# EAGLE board fc-comms (EAGLE 6.6.0), part 1 of 2
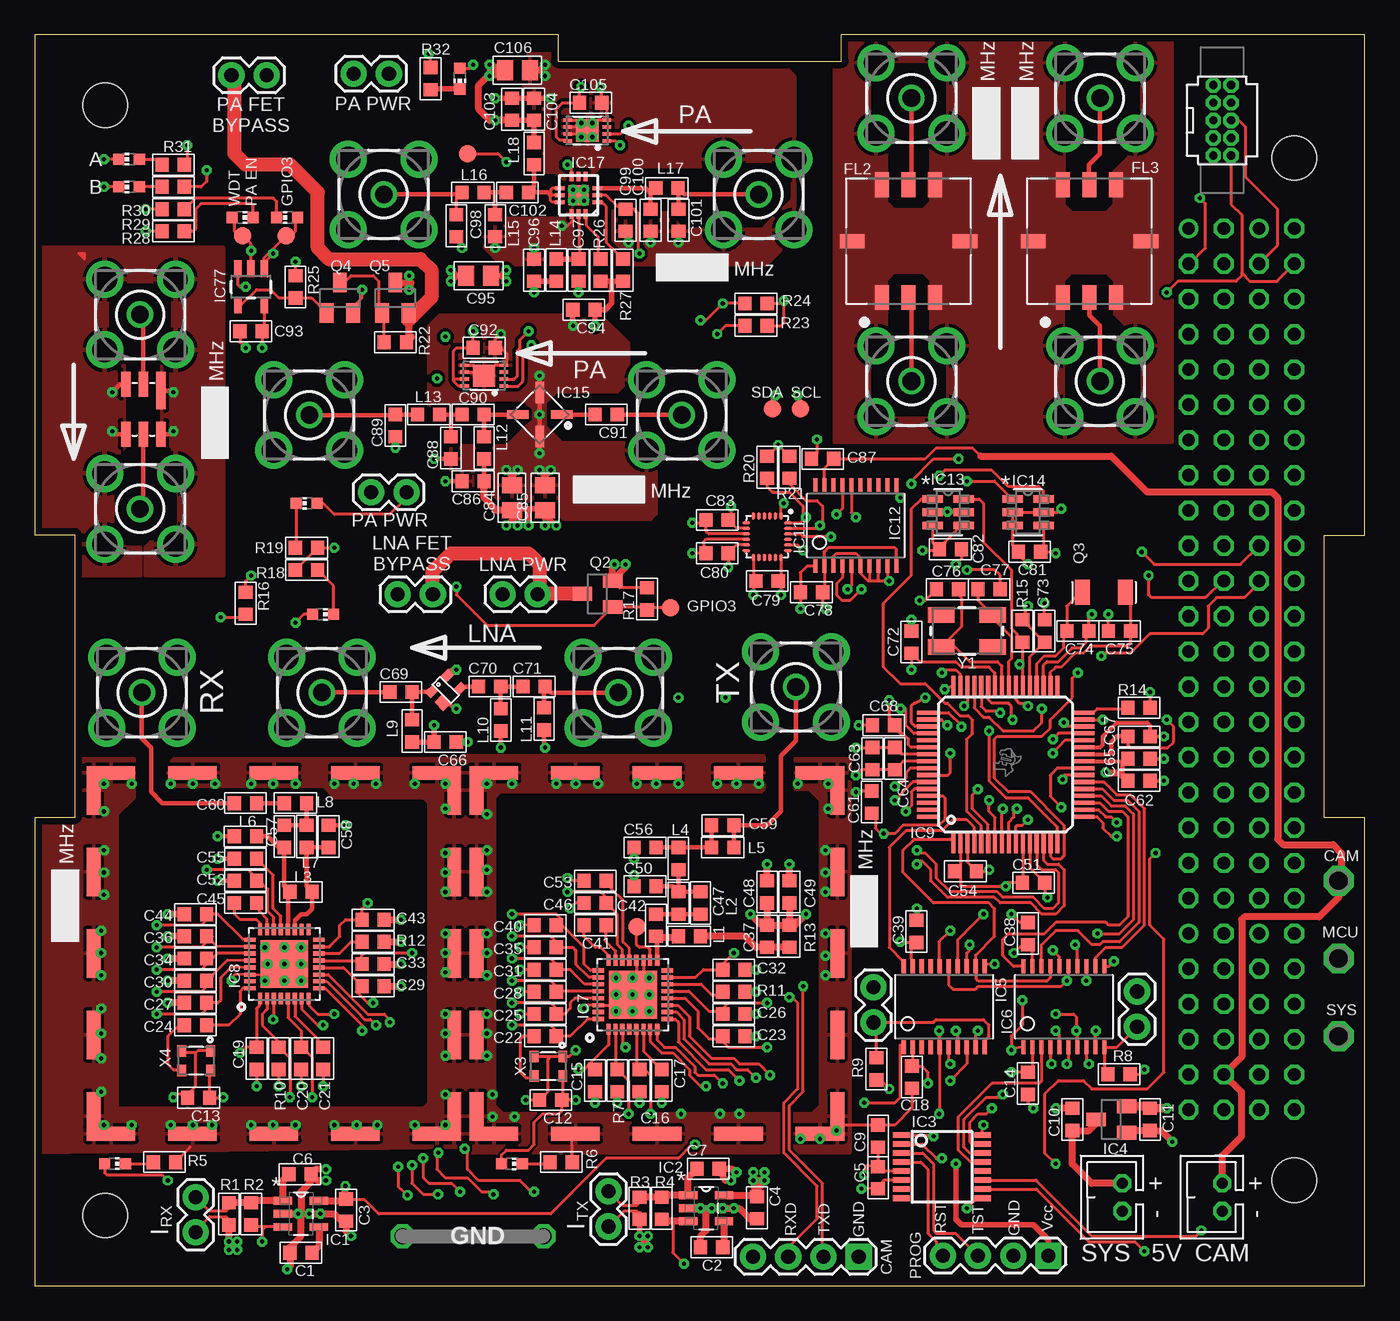
[diagram p2: board, top side]
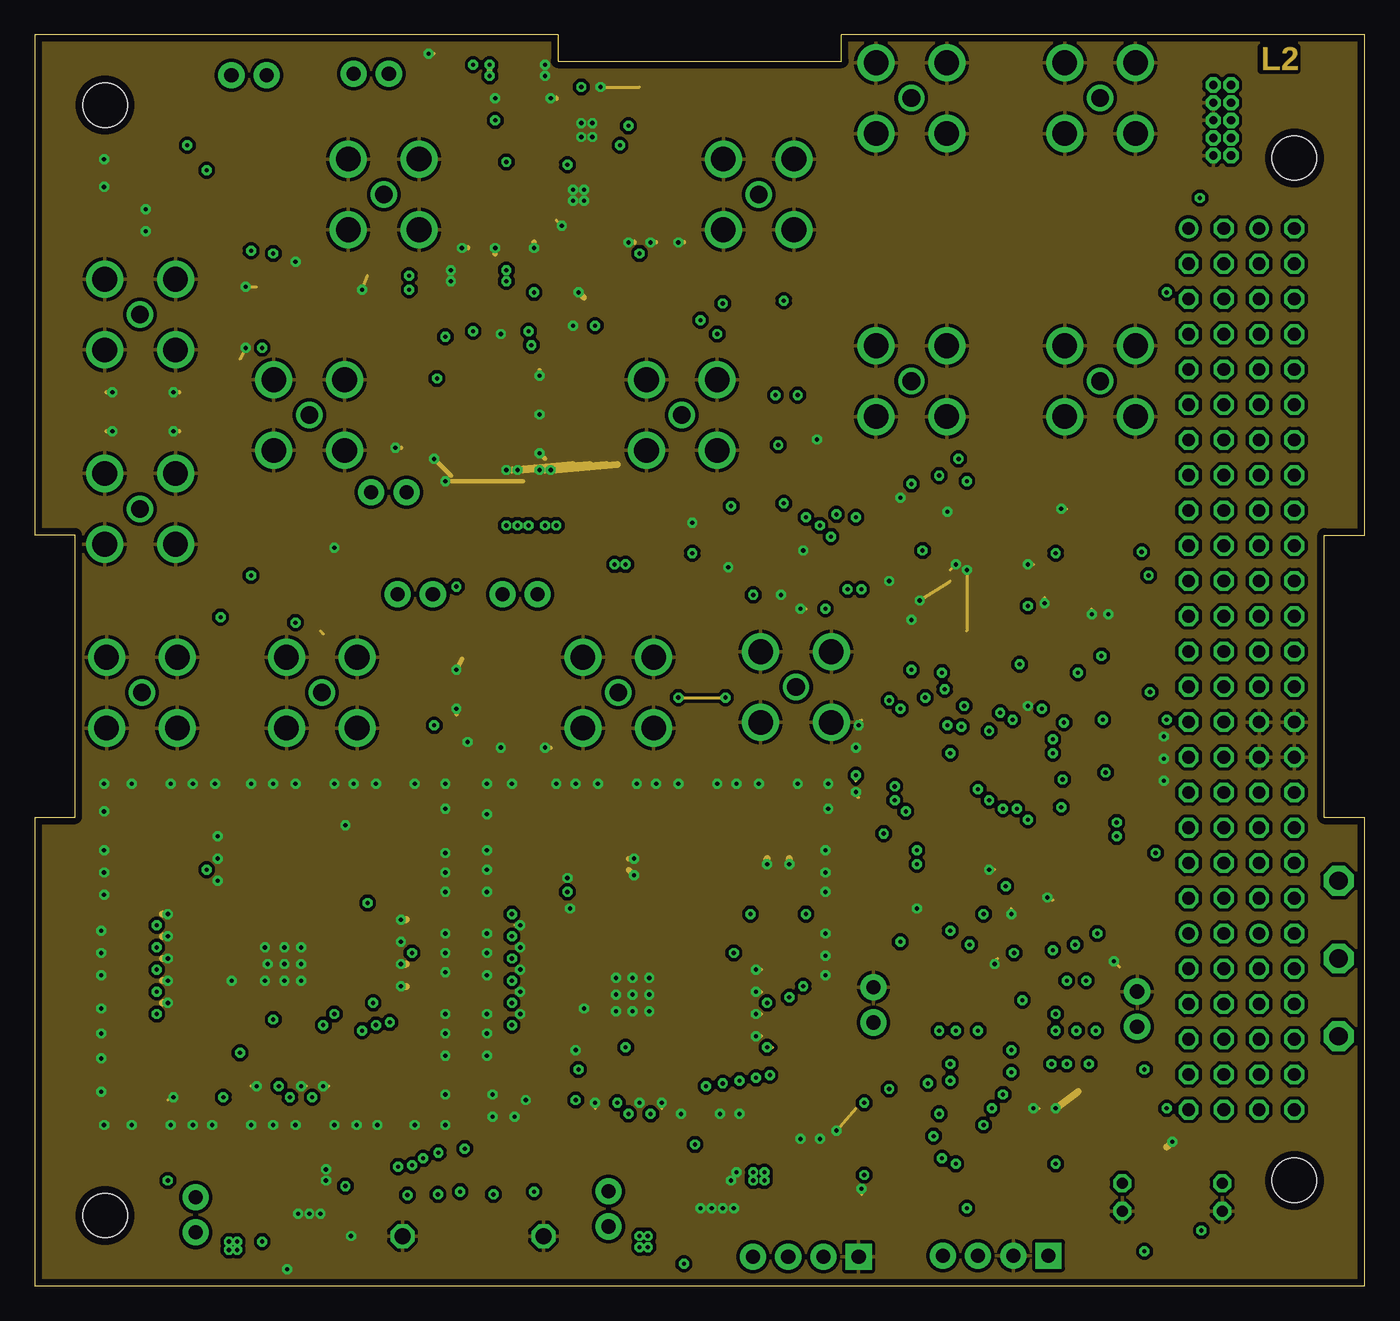
[diagram p3: board, inner layer Route2]
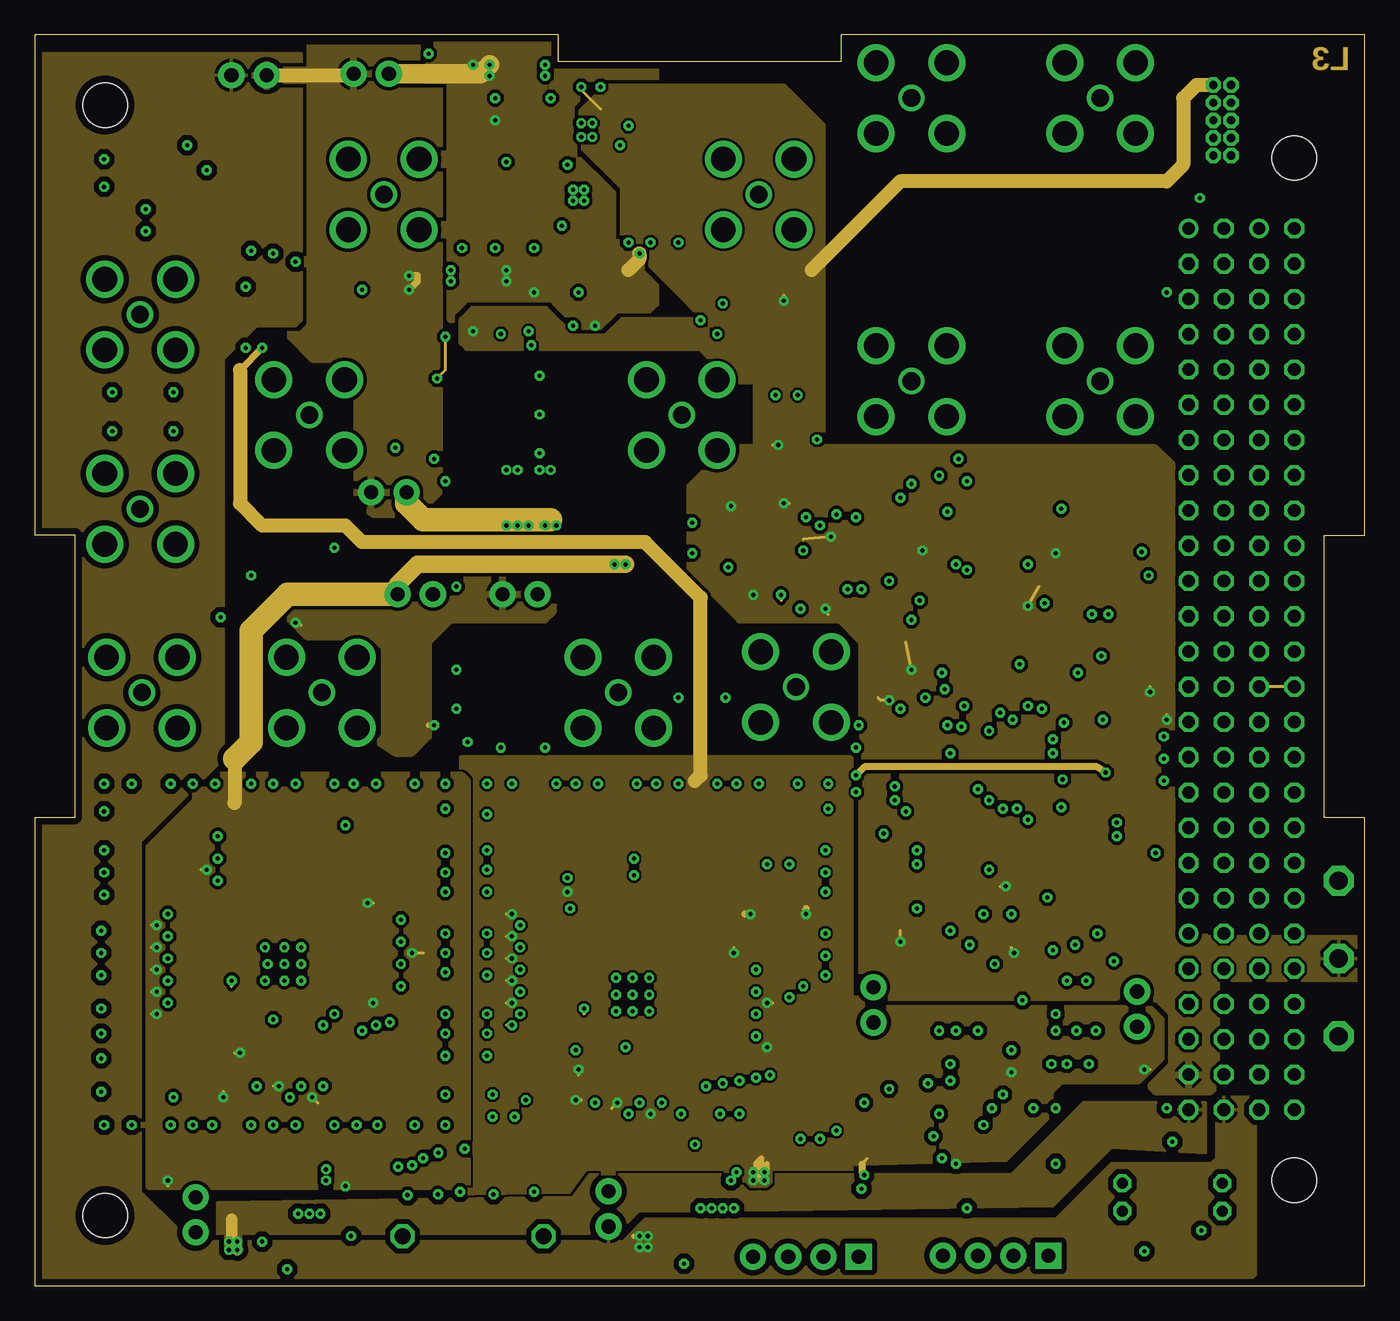
[diagram p4: board, inner layer Route15]
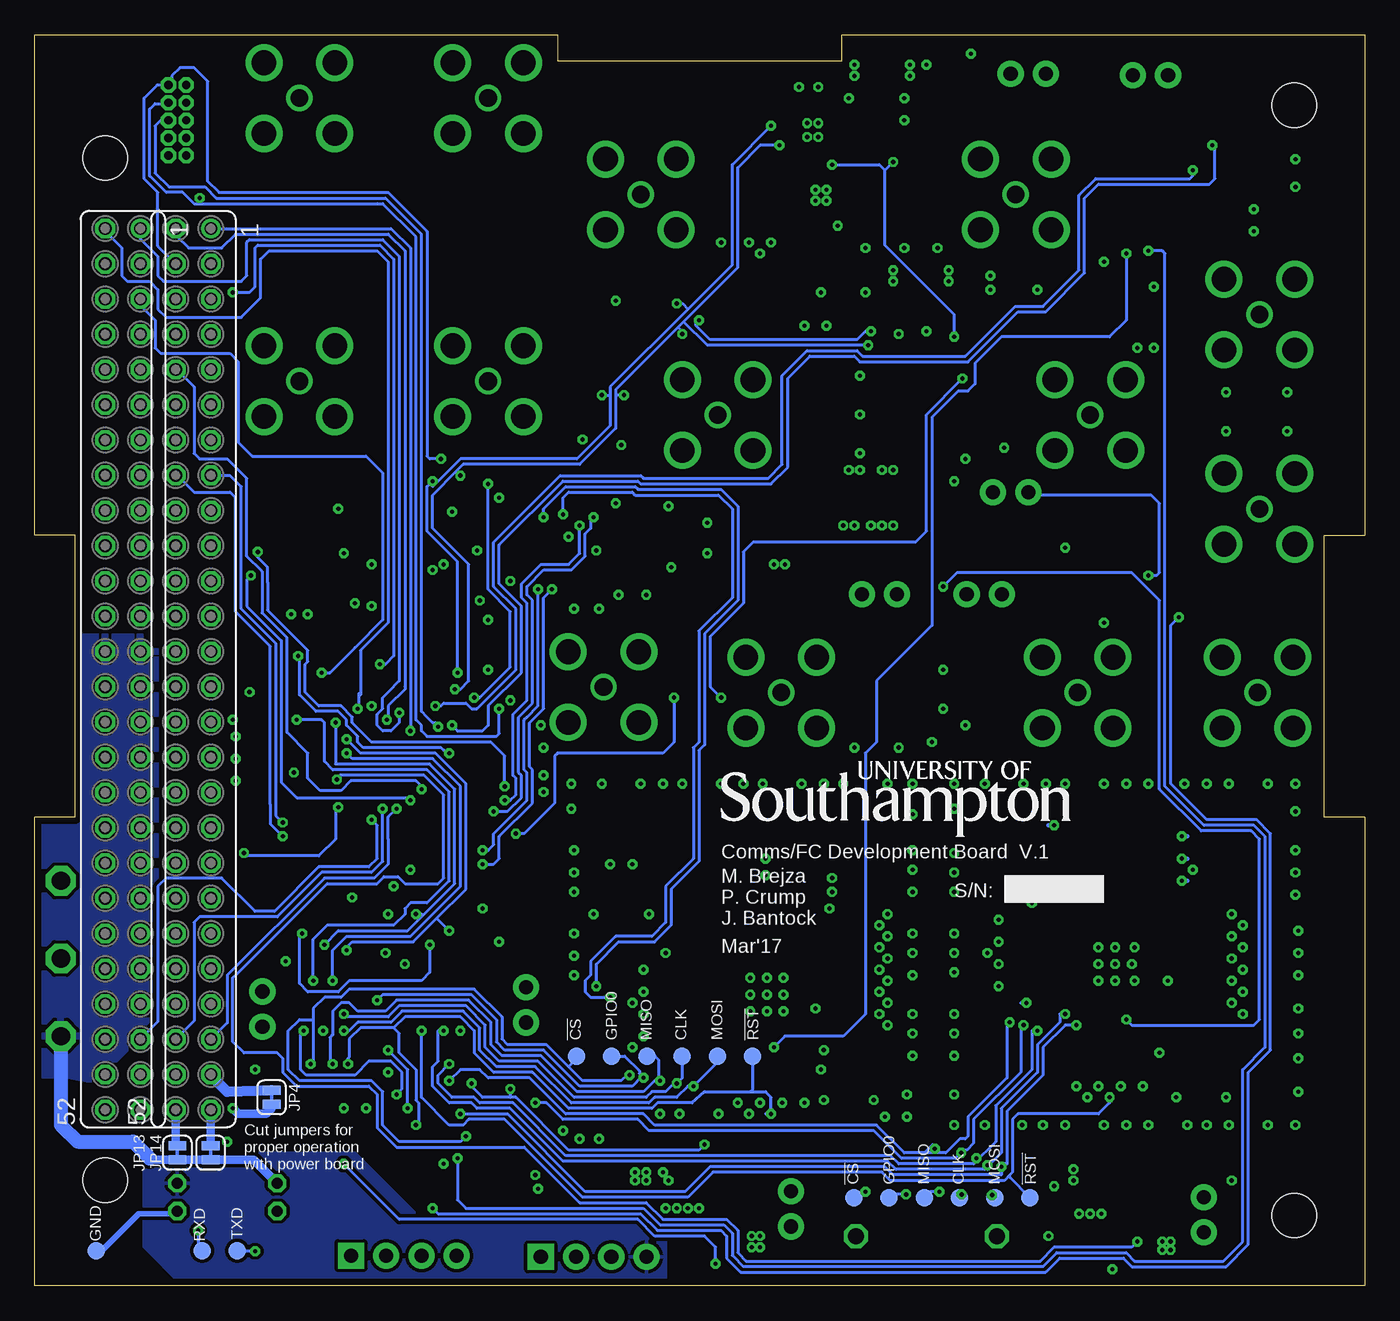
[diagram p5: board, bottom side, seen from below]

Size 95.89 x 90.17 mm. Coordinates in mm from the lower left corner, seen from the top.
Copper layers (1*2*15*16): Top 0.035mm / dielectric 0.15mm / Route2 0.035mm / dielectric 1.2mm / Route15 0.035mm / dielectric 0.15mm / Bottom 0.035mm
Design rules "default *": minimum track width 0.2mm, minimum drill 12mil, track to track 7mil, track to pad 7mil, pad to pad 7mil, via to via 8mil, smd to smd 5mil, copper to edge 20mil, drill to drill 8mil, minimum pad ring 10mil, minimum via ring 8mil, stop-mask expansion 4mil, vias tented up to drill 15mil, thermal gap 10mil

## Footprints (pad centres in the part's own frame; a part is rotated, then mirrored left to right if it is on the bottom)
C0603-N = smd 0.95 x 1: 1 -0.8,0; 2 0.8,0
C0805-N = smd 1.15 x 1.45: 1 -0.9,0; 2 0.9,0
GOLLEDGE_SAW = smd 2.7 x 0.7: A 1.35,-1.27 | smd 1.8 x 0.7: B 1.8,0; C 1.8,1.27; D -1.8,1.27; E -1.8,0; F -1.8,-1.27
PL-176 = smd 1.016 x 1.778: 1 -1.905,-4.064; 2 0,-4.064; 3 1.905,-4.064; 5 1.905,4.064; 6 0,4.064; 7 -1.905,4.064 | smd 1.778 x 1.016: 4 4.064,0; 8 -4.064,0
GND-LOOP-0.4 = drill 1.15 octagon: P$3 -5.08,0; P$4 5.08,0
SOT95P280X110-5N = smd 1.321 x 0.559: 1 -1.295,0.94; 2 -1.295,0; 3 -1.295,-0.94; 4 1.295,-0.94; 5 1.295,0.94
SSOP16 = smd 0.4 x 1.2: 1 -2.275,-2.925; 2 -1.625,-2.925; 3 -0.975,-2.925; 4 -0.325,-2.925; 5 0.325,-2.925; 6 0.975,-2.925; 7 1.625,-2.925; 8 2.275,-2.925; 9 2.275,2.925; 10 1.625,2.925; 11 0.975,2.925; 12 0.325,2.925; 13 -0.325,2.925; 14 -0.975,2.925; 15 -1.625,2.925; 16 -2.275,2.925
SOT23 = smd 1 x 1.4: 1 -0.95,-1.1; 2 0.95,-1.1; 3 0,1.1
TSSOP20 = smd 0.305 x 0.991: 1 -2.925,-2.918; 2 -2.275,-2.918; 3 -1.625,-2.918; 4 -0.975,-2.918; 5 -0.325,-2.918; 6 0.325,-2.918; 7 0.975,-2.918; 8 1.625,-2.918; 9 2.275,-2.918; 10 2.925,-2.918; 11 2.925,2.918; 12 2.275,2.918; 13 1.625,2.918; 14 0.975,2.918; 15 0.325,2.918; 16 -0.325,2.918; 17 -0.975,2.918; 18 -1.625,2.918; 19 -2.275,2.918; 20 -2.925,2.918
QFN32_5X5 = smd 0.813 x 0.305: 1 -2.489,1.753; 2 -2.489,1.245; 3 -2.489,0.762; 4 -2.489,0.254; 5 -2.489,-0.254; 6 -2.489,-0.762; 7 -2.489,-1.245; 8 -2.489,-1.753; 17 2.489,-1.753; 18 2.489,-1.245; 19 2.489,-0.762; 20 2.489,-0.254; 21 2.489,0.254; 22 2.489,0.762; 23 2.489,1.245; 24 2.489,1.753 | smd 0.305 x 0.813: 9 -1.753,-2.489; 10 -1.245,-2.489; 11 -0.762,-2.489; 12 -0.254,-2.489; 13 0.254,-2.489; 14 0.762,-2.489; 15 1.245,-2.489; 16 1.753,-2.489; 25 1.753,2.489; 26 1.245,2.489; 27 0.762,2.489; 28 0.254,2.489; 29 -0.254,2.489; 30 -0.762,2.489; 31 -1.245,2.489; 32 -1.753,2.489 | smd 3.45 x 3.45: 33 0,0
PM_S-PQFP-G64 = smd 1.6 x 0.3: 1 -5.6,3.75; 2 -5.6,3.25; 3 -5.6,2.75; 4 -5.6,2.25; 5 -5.6,1.75; 6 -5.6,1.25; 7 -5.6,0.75; 8 -5.6,0.25; 9 -5.6,-0.25; 10 -5.6,-0.75; 11 -5.6,-1.25; 12 -5.6,-1.75; 13 -5.6,-2.25; 14 -5.6,-2.75; 15 -5.6,-3.25; 16 -5.6,-3.75; 33 5.6,-3.75; 34 5.6,-3.25; 35 5.6,-2.75; 36 5.6,-2.25; 37 5.6,-1.75; 38 5.6,-1.25; 39 5.6,-0.75; 40 5.6,-0.25; 41 5.6,0.25; 42 5.6,0.75; 43 5.6,1.25; 44 5.6,1.75; 45 5.6,2.25; 46 5.6,2.75; 47 5.6,3.25; 48 5.6,3.75 | smd 0.3 x 1.6: 17 -3.75,-5.6; 18 -3.25,-5.6; 19 -2.75,-5.6; 20 -2.25,-5.6; 21 -1.75,-5.6; 22 -1.25,-5.6; 23 -0.75,-5.6; 24 -0.25,-5.6; 25 0.25,-5.6; 26 0.75,-5.6; 27 1.25,-5.6; 28 1.75,-5.6; 29 2.25,-5.6; 30 2.75,-5.6; 31 3.25,-5.6; 32 3.75,-5.6; 49 3.75,5.6; 50 3.25,5.6; 51 2.75,5.6; 52 2.25,5.6; 53 1.75,5.6; 54 1.25,5.6; 55 0.75,5.6; 56 0.25,5.6; 57 -0.25,5.6; 58 -0.75,5.6; 59 -1.25,5.6; 60 -1.75,5.6; 61 -2.25,5.6; 62 -2.75,5.6; 63 -3.25,5.6; 64 -3.75,5.6
LNA_MMM1362 = smd 0.6 x 0.8: 1 0,0; 3 1.3,1.6; 4 0,1.6 | smd 0.9 x 0.8: 2 1.15,0
QFN-24/3MM = smd 0.6 x 0.23: 1 -1.5,1; 2 -1.5,0.6; 3 -1.5,0.2; 4 -1.5,-0.2; 5 -1.5,-0.6; 6 -1.5,-1; 13 1.5,-1; 14 1.5,-0.6; 15 1.5,-0.2; 16 1.5,0.2; 17 1.5,0.6; 18 1.5,1 | smd 0.23 x 0.6: 7 -1,-1.5; 8 -0.6,-1.5; 9 -0.2,-1.5; 10 0.2,-1.5; 11 0.6,-1.5; 12 1,-1.5; 19 1,1.5; 20 0.6,1.5; 21 0.2,1.5; 22 -0.2,1.5; 23 -0.6,1.5; 24 -1,1.5
DBV6 = smd 1.473 x 0.559: 1 -1.118,0.95; 2 -1.118,0; 3 -1.118,-0.95; 4 1.118,-0.95; 5 1.118,0; 6 1.118,0.95
PA = smd 1.55 x 0.61: GND1 -1.59,0; GND2 1.59,0 | smd 0.61 x 1.55: RF_IN 0,-1.59; RF_OUT 0,1.59
HWSON8 = smd 0.25 x 0.625: 1 -0.75,-1.41; 2 -0.25,-1.41; 3 0.25,-1.41; 4 0.75,-1.41; 5 0.75,1.41; 6 0.25,1.41; 7 -0.25,1.41; 8 -0.75,1.41 | smd 1.6 x 1.6: EP 0,0
QFN3X3-6 = smd 0.7 x 0.3: 1 -1.35,0.5; 2 -1.35,0; 3 -1.35,-0.5; 7 1.35,-0.5; 8 1.35,0; 9 1.35,0.5 | smd 0.3 x 0.7: 4 -0.5,-1.35; 5 0,-1.35; 6 0.5,-1.35; 10 0.5,1.35; 11 0,1.35; 12 -0.5,1.35 | smd 1.45 x 1.45: EXP 0,0
SOT23-5 = smd 0.55 x 1.2: 1 -0.95,-1.3; 2 0,-1.3; 3 0.95,-1.3; 4 0.95,1.3; 5 -0.95,1.3
JST-2-TH = drill 0.8 octagon: 1 1,0; 2 -1,0
SWD_PTH_SHROUD = drill 0.6 octagon: 1 -2.54,-0.635; 2 -2.54,0.635; 3 -1.27,-0.635; 4 -1.27,0.635; 5 0,-0.635; 6 0,0.635; 7 1.27,-0.635; 8 1.27,0.635; 9 2.54,-0.635; 10 2.54,0.635
1X04 = drill 1.016 pad 1.88 square: 1 0,0 | drill 1.016 pad 1.88: 2 2.54,0; 3 5.08,0; 4 7.62,0
1X02 = drill 1.016 pad 1.88: 1 0,0; 2 2.54,0
SMT-JUMPER_2_NC_TRACE_SILK = smd 0.635 x 1.27: 1 -0.508,0; 2 0.508,0
L0603-N = smd 0.95 x 1: 1 -0.8,0; 2 0.8,0
CHIP-LED0603 = smd 0.8 x 0.8: A 0,-0.75; C 0,0.75
RESONATOR_EPSON_FC_145 = smd 1.1 x 1.8: P$1 -1.55,0; P$2 1.55,0
R0603-N = smd 0.95 x 1: 1 -0.8,0; 2 0.8,0
FE26-2 = drill 0.914: 1 -30.48,1.27; 41 20.32,1.27 | drill 0.914 octagon: 2 -30.48,-1.27; 3 -27.94,1.27; 4 -27.94,-1.27; 5 -25.4,1.27; 6 -25.4,-1.27; 7 -22.86,1.27; 8 -22.86,-1.27; 9 -20.32,1.27; 10 -20.32,-1.27; 11 -17.78,1.27; 12 -17.78,-1.27; 13 -15.24,1.27; 14 -15.24,-1.27; 15 -12.7,1.27; 16 -12.7,-1.27; 17 -10.16,1.27; 18 -10.16,-1.27; 19 -7.62,1.27; 20 -7.62,-1.27; 21 -5.08,1.27; 22 -5.08,-1.27; 23 -2.54,1.27; 24 -2.54,-1.27; 25 0,1.27; 26 0,-1.27; 27 2.54,1.27; 28 2.54,-1.27; 29 5.08,1.27; 30 5.08,-1.27; 31 7.62,1.27; 32 7.62,-1.27; 33 10.16,1.27; 34 10.16,-1.27; 35 12.7,1.27; 36 12.7,-1.27; 37 15.24,1.27; 38 15.24,-1.27; 39 17.78,1.27; 40 17.78,-1.27; 42 20.32,-1.27; 43 22.86,1.27; 44 22.86,-1.27; 45 25.4,1.27; 46 25.4,-1.27; 47 27.94,1.27; 48 27.94,-1.27; 49 30.48,1.27; 50 30.48,-1.27; 51 33.02,1.27; 52 33.02,-1.27
P1-13 = drill 1.321 pad 2.159 octagon: TP 0,0
B1,27 = smd 1.27 x 1.27: TP 0,0
OUTLINE = hole 3.2: 5.08,5.08; 5.08,85.09; 90.805,7.62; 90.805,81.28
SHIELD-26X26 = smd 3.5 x 1: G1 1.75,0.5; G7 25.25,26.5; G8 1.75,26.5; G9 13.5,26.5; G10 7.625,26.5; G11 19.375,26.5; G17 25.25,0.5; G19 13.5,0.5; G20 7.625,0.5; G21 19.375,0.5 | smd 1 x 3.5: G2 0.5,1.75; G3 0.5,25.25; G4 0.5,13.5; G5 0.5,19.375; G6 0.5,7.625; G12 26.5,1.75; G13 26.5,25.25; G14 26.5,13.5; G15 26.5,19.375; G16 26.5,7.625
260-SERIES = smd 0.63 x 0.84: 1 -1.04,-0.7; 3 1.04,-0.7; 4 1.04,0.7; 6 -1.04,0.7
BU-SMA-V = drill 1.27: 1 0,0 | drill 1.778: 2 -2.55,2.55; 3 2.55,2.55; 4 2.55,-2.55; 5 -2.55,-2.55
CRYSTAL-SMD-5X3.2-4PAD = smd 1.9 x 1.1: 1 -1.85,-1.15; 2 1.85,-1.15; 3 1.85,1.15; 4 -1.85,1.15

## Placement (x,y rotation side)
C1  10n  [C0603-N]  19.2,2.4 180 top
C2  10n  [C0603-N]  48.8,2.8 180 top
C3  2u2  [C0603-N]  22.46,5.47 270 top
C4  2u2  [C0603-N]  52.06,5.64 270 top
C5  1u  [C0603-N]  60.8,7.8 270 top
C6  2u2  [C0603-N]  19.12,8.06 0 top
C7  2u2  [C0603-N]  48.55,8.46 0 top
C9  100n  [C0603-N]  60.8,10.8 90 top
C10  4.7u  [C0603-N]  74.8,12 90 top
C11  4.7u  [C0603-N]  80.4,12 270 top
C12  100n  [C0603-N]  37.2,13.4 180 top
C13  100n  [C0603-N]  11.82,13.56 180 top
C14  100n  [C0603-N]  71.6,14.6 270 top
C15  47n  [C0603-N]  40.4,14.8 90 top
C16  47n  [C0603-N]  43.6,14.8 90 top
C17  220n  [C0603-N]  45.2,14.8 270 top
C18  100n  [C0603-N]  63.24,15.06 270 top
C19  47n  [C0603-N]  16,16.4 90 top
C20  47n  [C0603-N]  19.2,16.4 90 top
C21  220n  [C0603-N]  20.8,16.4 270 top
C22  10n  [C0603-N]  36.8,18 0 top
C23  47n  [C0603-N]  50.4,18 180 top
C24  10n  [C0603-N]  11.6,18.8 0 top
C25  47n  [C0603-N]  36.8,19.6 0 top
C26  47n  [C0603-N]  50.4,19.6 180 top
C27  47n  [C0603-N]  11.6,20.4 0 top
C28  47n  [C0603-N]  36.8,21.2 0 top
C29  47n  [C0603-N]  24.4,21.6 180 top
C30  47n  [C0603-N]  11.6,22 0 top
C31  47n  [C0603-N]  36.8,22.8 0 top
C32  47n  [C0603-N]  50.4,22.8 180 top
C33  47n  [C0603-N]  24.4,23.2 180 top
C34  47n  [C0603-N]  11.6,23.6 0 top
C35  47n  [C0603-N]  36.8,24.4 0 top
C36  47n  [C0603-N]  11.6,25.2 0 top
C37  100p  [C0603-N]  52.8,25.2 270 top
C38  100n  [C0603-N]  71.6,25.4 90 top
C39  100n  [C0603-N]  63.56,25.55 90 top
C40  47n  [C0603-N]  36.8,26 0 top
C41  1.8n  [C0603-N]  40.4,26 180 top
C42  82p  [C0603-N]  44.8,26 90 top
C43  47n  [C0603-N]  24.4,26.4 180 top
C44  47n  [C0603-N]  11.6,26.8 0 top
C45  1.8n  [C0603-N]  15.2,27.6 180 top
C46  47n  [C0603-N]  40.4,27.6 0 top
C47  12p  [C0603-N]  46.4,27.6 90 top
C48  100p  [C0603-N]  52.8,28.4 90 top
C49  10n  [C0603-N]  54.4,28.4 90 top
C50  12p  [C0603-N]  44,28.8 0 top
C51  0.01u  [C0603-N]  72.01,29.06 0 top
C52  47n  [C0603-N]  15.2,29.2 0 top
C53  10n  [C0603-N]  40.4,29.2 180 top
C54  1.0u  [C0603-N]  67.09,29.88 0 top
C55  10n  [C0603-N]  15.2,30.8 180 top
C56  15p  [C0603-N]  44,31.6 0 top
C57  5.1p  [C0603-N]  18,32.4 90 top
C58  5.1p  [C0603-N]  21.2,32.4 90 top
C59  1.2p  [C0603-N]  49.6,33.2 0 top
C60  [C0603-N]  15.2,34.8 180 top
C61  100p  [C0603-N]  60.34,34.87 90 top
C62  2.2u  [C0603-N]  79.6,36.4 0 top
C63  0.1u  [C0603-N]  60.4,38 90 top
C64  0.1u  [C0603-N]  62,38 90 top
C65  1.0u  [C0603-N]  79.6,38 0 top
C66  ??  [C0603-N]  29.6,39.2 180 top
C67  0.01u  [C0603-N]  79.6,39.6 0 top
C68  0.01u  [C0603-N]  61.2,40.4 180 top
C69  ??  [C0603-N]  26.4,42.8 0 top
C70  ??  [C0603-N]  32.8,43.2 0 top
C71  0R  [C0603-N]  36,43.2 0 top
C72  0.1u  [C0603-N]  63.2,46.4 90 top
C73  0.1u  [C0603-N]  72.8,47.2 90 top
C74  24p  [C0603-N]  75.2,47.2 0 top
C75  24p  [C0603-N]  78.2,47.2 180 top
C76  10p  [C0603-N]  65.8,50.2 180 top
C77  10p  [C0603-N]  68.8,50.2 0 top
C78  0.1u  [C0603-N]  56,50 180 top
C79  0.1u  [C0603-N]  52.8,50.8 0 top
C80  0.1u  [C0603-N]  49.2,52.8 0 top
C81  0.1u  [C0603-N]  71.71,52.92 180 top
C82  0.1u  [C0603-N]  66.01,53.08 0 top
C83  0.01u  [C0603-N]  49.2,55.2 180 top
C84  [C0805-N]  34.4,56.8 90 top
C85  [C0805-N]  36.8,56.8 90 top
C86  ??  [C0603-N]  31.6,58 0 top
C87  0.1u  [C0603-N]  56.8,59.6 180 top
C88  dnp  [C0603-N]  30,60.4 90 top
C89  dnp  [C0603-N]  26,62 90 top
C90  ??  [C0603-N]  31.6,62.8 180 top
C91  1n  [C0603-N]  41.2,62.8 180 top
C92  100n  [C0603-N]  32.4,67.6 0 top
C93  100n  [C0603-N]  15.6,68.8 180 top
C94  1u  [C0603-N]  39.59,70.34 180 top
C95  [C0805-N]  32,72.8 180 top
C96  1u  [C0603-N]  36,73.2 90 top
C97  3.3p  [C0603-N]  39.2,73.2 270 top
C98  33p  [C0603-N]  30.4,76.4 270 top
C99  100p  [C0603-N]  42.6,76.8 270 top
C100  27p  [C0603-N]  44.4,76.8 270 top
C101  15p  [C0603-N]  46.4,76.8 270 top
C102  220p  [C0603-N]  34.8,78.8 0 top
C103  4.7u  [C0603-N]  34.4,84.8 90 top
C104  1n  [C0603-N]  36,84.8 90 top
C105  100n  [C0603-N]  40.08,85.26 0 top
C106  [C0805-N]  34.8,87.6 0 top
FL1  GOLLEDGE_SAW_FILTER  [GOLLEDGE_SAW]  7.84,63.18 90 top
FL2  SAW_FILTER_CS  [PL-176]  62.99,75.29 0 top
FL3  LPF_CS  [PL-176]  76.03,75.29 0 top
G1  GND-LOOPL  [GND-LOOP-0.4]  31.6,3.6 0 top
IC1  TPS79930QDDCRQ1  [SOT95P280X110-5N]  19.2,5.2 0 top
IC2  TPS79930QDDCRQ1  [SOT95P280X110-5N]  48.4,5.6 0 top
IC3  MSP430FR2311PW  [SSOP16]  65.41,8.6 270 top
IC4  MCP1700TT  [SOT23]  77.6,12 90 top
IC5  TXB0108PW  [TSSOP20]  65.56,20.12 0 top
IC6  TXB0108PW  [TSSOP20]  74.19,20.12 0 top
IC7  CC1125RHBT  [QFN32_5X5]  43.12,20.99 90 top
IC8  CC1125RHBT  [QFN32_5X5]  18,23.2 90 top
IC9  TM4C123[7,G]XXPM  [PM_S-PQFP-G64]  69.98,37.57 90 top
IC10  LNA_COMMON  [LNA_MMM1362]  28.6,42.84 315 top
IC11  MPU-9250  [QFN-24/3MM]  52.8,54 270 top
IC12  TXB0108PW  [TSSOP20]  59.2,54.8 0 top
IC13  TPS3813K33-EP_DBV_6  [DBV6]  65.85,55.76 0 top
IC14  TMP100-EP_DBV_6  [DBV6]  71.6,55.76 0 top
IC15  LHA1+  [PA]  36.4,62.8 90 top
IC16  PCT2075TP  [HWSON8]  32.4,65.6 90 top
IC17  MMZ09332BT1  [QFN3X3-6]  39.2,78.6 180 top
IC18  PCT2075TP  [HWSON8]  39.84,83.27 90 top
IC77  74LVC1G08  [SOT23-5]  15.6,72 180 top
J1  [JST-2-TH]  78.4,6.4 90 top
J2  [JST-2-TH]  85.6,6.4 90 top
J3  SWD_SHROUD  [SWD_PTH_SHROUD]  85.6,84 270 top
JP1  [1X04]  73.08,2.19 180 top
JP2  M02PTH  [1X02]  41.36,4.29 90 top
JP3  M02PTH  [1X02]  11.6,6.4 270 top
JP4  JUMPER-SMT_2_NC_TRACE_SILK  [SMT-JUMPER_2_NC_TRACE_SILK]  78.8,13.6 90 bottom
JP5  M02PTH  [1X02]  79.47,18.68 90 top
JP6  M02PTH  [1X02]  60.47,18.99 90 top
JP7  M02PTH  [1X02]  26.16,49.84 0 top
JP8  M02PTH  [1X02]  33.72,49.84 0 top
JP9  M02PTH  [1X02]  26.8,57.2 180 top
JP10  M02PTH  [1X02]  14.18,87.24 0 top
JP11  M02PTH  [1X02]  25.53,87.36 180 top
JP12  [1X04]  59.4,2.1 180 top
JP13  JUMPER-SMT_2_NC_TRACE_SILK  [SMT-JUMPER_2_NC_TRACE_SILK]  85.6,9.6 90 bottom
JP14  JUMPER-SMT_2_NC_TRACE_SILK  [SMT-JUMPER_2_NC_TRACE_SILK]  83.2,9.6 90 bottom
L1  220n  [L0603-N]  47.2,25.2 0 top
L2  18n  [L0603-N]  48,27.6 90 top
L3  56n  [L0603-N]  19.2,28.4 0 top
L4  100n  [L0603-N]  46.4,30.8 90 top
L5  68n  [L0603-N]  49.6,31.6 0 top
L6  27n  [L0603-N]  15.2,32.4 0 top
L7  27u  [L0603-N]  19.6,32.4 90 top
L8  15n  [L0603-N]  18.8,34.8 180 top
L9  ??  [L0603-N]  27.2,40 270 top
L10  dnp  [L0603-N]  33.6,40.8 90 top
L11  dnp  [L0603-N]  36.72,40.87 90 top
L12  220n  [L0603-N]  32.4,60.4 270 top
L13  0R  [L0603-N]  28.4,62.8 180 top
L14  33n  [L0603-N]  37.6,73.2 270 top
L15  33n  [L0603-N]  33.2,76.4 90 top
L16  33n  [L0603-N]  31.6,78.8 180 top
L17  22n  [L0603-N]  45.57,79.12 180 top
L18  33n  [L0603-N]  36,81.6 90 top
LED1  [CHIP-LED0603]  34.4,8.8 270 top
LED2  [CHIP-LED0603]  5.79,8.82 270 top
LED3  [CHIP-LED0603]  20.8,48.4 270 top
LED4  [CHIP-LED0603]  19.6,56.4 90 top
LED5  [CHIP-LED0603]  15,77 270 top
LED6  [CHIP-LED0603]  18.2,77 90 top
LED7  [CHIP-LED0603]  6.8,79.2 90 top
LED8  [CHIP-LED0603]  6.8,81.2 90 top
LED9  [CHIP-LED0603]  30.65,87.01 180 top
Q2  BSS84  [SOT23]  40.56,49.88 90 top
Q3  32.768kHz  [RESONATOR_EPSON_FC_145]  77.08,49.98 0 top
Q4  BSS123  [SOT23]  22,71.2 0 top
Q5  BSS84  [SOT23]  26,71.2 0 top
R1  0.2  [R0603-N]  14,5.2 90 top
R2  10k  [R0603-N]  15.6,5.2 90 top
R3  0.2  [R0603-N]  43.6,5.6 90 top
R4  10k  [R0603-N]  45.2,5.6 90 top
R5  [R0603-N]  9.36,8.93 0 top
R6  [R0603-N]  37.95,8.93 0 top
R7  100k  [R0603-N]  42,14.8 270 top
R8  10k  [R0603-N]  78.16,15.27 0 top
R9  10k  [R0603-N]  60.67,15.65 270 top
R10  100k  [R0603-N]  17.6,16.4 270 top
R11  56k 0.5%  [R0603-N]  50.4,21.2 0 top
R12  56k 0.5%  [R0603-N]  24.4,24.8 0 top
R13  22  [R0603-N]  54.4,25.2 90 top
R14  1M  [R0603-N]  79.61,41.66 0 top
R15  10k  [R0603-N]  71.2,47.2 90 top
R16  10k  [R0603-N]  15.2,49.2 270 top
R17  100k  [R0603-N]  44.13,49.51 90 top
R18  [R0603-N]  19.6,51.6 180 top
R19  [R0603-N]  19.6,53.2 0 top
R20  4k7  [R0603-N]  52.8,59 90 top
R21  4k7  [R0603-N]  54.4,59 90 top
R22  100k  [R0603-N]  26,68 0 top
R23  4k7  [R0603-N]  52,69.2 0 top
R24  4k7  [R0603-N]  52,70.8 0 top
R25  10k  [R0603-N]  18.8,72 270 top
R26  1.8k  [R0603-N]  40.8,73.2 90 top
R27  2.2k  [R0603-N]  42.4,73.2 90 top
R28  [R0603-N]  10,76 0 top
R29  [R0603-N]  10,77.6 0 top
R30  [R0603-N]  10,79.2 0 top
R31  [R0603-N]  10,80.8 0 top
R32  [R0603-N]  28.53,87 90 top
SV2  H1  [FE26-2]  84.45,45.72 270 bottom
SV3  H2  [FE26-2]  89.53,45.72 270 bottom
TP1  PTR1PAD1-13  [P1-13]  94,18 0 top
TP2  PTR1PAD1-13  [P1-13]  94,23.6 0 top
TP3  PTR1B1,27  [B1,27]  43.41,25.89 0 top
TP4  PTR1PAD1-13  [P1-13]  94,29.2 0 top
TP5  PTR1B1,27  [B1,27]  45.85,48.89 0 top
TP6  PTR1B1,27  [B1,27]  44.14,16.56 0 bottom
TP7  PTR1B1,27  [B1,27]  56.84,16.56 0 bottom
TP8  PTR1B1,27  [B1,27]  49.22,16.56 0 bottom
TP9  PTR1B1,27  [B1,27]  53.2,63.2 0 top
TP10  PTR1B1,27  [B1,27]  55.2,63.2 0 top
TP11  PTR1B1,27  [B1,27]  46.68,16.56 0 bottom
TP12  PTR1B1,27  [B1,27]  51.76,16.56 0 bottom
TP13  PTR1B1,27  [B1,27]  54.3,16.56 0 bottom
TP14  PTR1B1,27  [B1,27]  15.01,75.69 0 top
TP15  PTR1B1,27  [B1,27]  18.13,75.69 0 top
TP16  PTR1B1,27  [B1,27]  31.2,81.6 0 top
TP17  PTR1B1,27  [B1,27]  24.13,6.35 270 bottom
TP18  PTR1B1,27  [B1,27]  26.67,6.35 270 bottom
TP19  PTR1B1,27  [B1,27]  29.21,6.35 270 bottom
TP20  PTR1B1,27  [B1,27]  31.75,6.35 270 bottom
TP21  PTR1B1,27  [B1,27]  34.29,6.35 270 bottom
TP22  PTR1B1,27  [B1,27]  36.83,6.35 270 bottom
TP23  PTR1B1,27  [B1,27]  81.28,2.54 0 bottom
TP24  PTR1B1,27  [B1,27]  83.82,2.54 0 bottom
TP25  PTR1B1,27  [B1,27]  91.44,2.54 0 bottom
U$1  [OUTLINE]  0,0 0 top
U$2  [UOS_LOGO_SML]  46.4,32.4 0 bottom
X1  SHIELD-26X26  [SHIELD-26X26]  3.75,10.47 0 top
X2  SHIELD-26X26  [SHIELD-26X26]  31.36,10.47 0 top
X3  LFTCXO070  [260-SERIES]  37.03,15.84 180 top
X4  LFTCXO070  [260-SERIES]  11.64,16.24 180 top
X5  BU-SMA-V  [BU-SMA-V]  7.73,42.76 0 top
X6  BU-SMA-V  [BU-SMA-V]  20.7,42.76 0 top
X7  BU-SMA-V  [BU-SMA-V]  42.07,42.76 0 top
X8  BU-SMA-V  [BU-SMA-V]  54.88,43.16 0 top
X9  BU-SMA-V  [BU-SMA-V]  7.6,56 0 top
X10  BU-SMA-V  [BU-SMA-V]  19.79,62.76 0 top
X11  BU-SMA-V  [BU-SMA-V]  46.65,62.76 0 top
X12  BU-SMA-V  [BU-SMA-V]  63.2,65.2 0 top
X13  BU-SMA-V  [BU-SMA-V]  76.8,65.2 0 top
X14  BU-SMA-V  [BU-SMA-V]  7.6,70 0 top
X15  BU-SMA-V  [BU-SMA-V]  25.16,78.66 0 top
X16  BU-SMA-V  [BU-SMA-V]  52.19,78.66 0 top
X17  BU-SMA-V  [BU-SMA-V]  63.2,85.6 0 top
X18  BU-SMA-V  [BU-SMA-V]  76.8,85.6 0 top
Y1  8MHz  [CRYSTAL-SMD-5X3.2-4PAD]  67.2,47.2 180 top